# Altium schematic sheet DCDC_L5973D.SchDoc
size A4
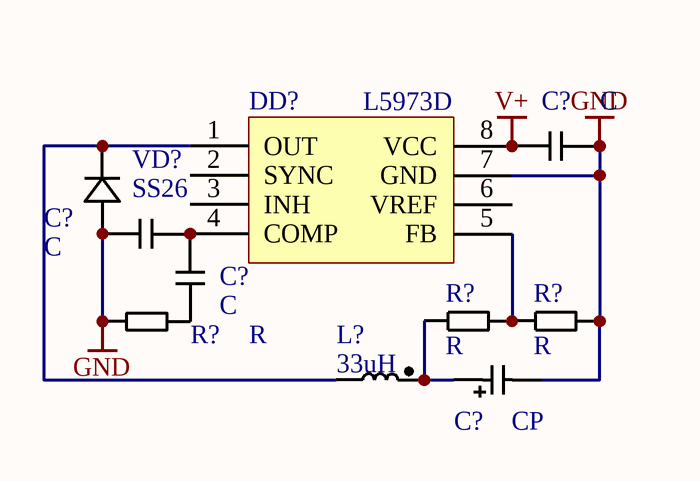
[diagram p0: DCDC_L5973D.SchDoc]

## Parts
(Parts that share a designator on the sheet are numbered #1, #2 ... from top to bottom, then left to right.)
C?#1  C  [C0805]
C?#2  C  [C0603]
C?#3  C  [C0603]
C?#4  CP  [SMD A]
DD?  L5973D  [HSOP-8EP]
L?  33uH  [SDR0403]
R?#1  R  [R0603]
R?#2  R  [R0603]
R?#3  R  [R0603]
VD?  SS26  [DO214]

## Nets
GND: C?#1.2 C?#2.1 C?#4.2 DD?.7(GND) R?#1.1 R?#3.2 VD?.1(K)
V+: C?#1.1 DD?.8(VCC)
NetC?#2_2: C?#2.2 C?#3.1 DD?.4(COMP)
NetC?#3_2: C?#3.2 R?#1.2
NetC?#4_1: C?#4.1 L?.1 R?#2.1
NetDD?_1: DD?.1(OUT) L?.2 VD?.2(A)
NetDD?_5: DD?.5(FB) R?#2.2 R?#3.1

Not connected (* = marked no-connect by the designer): DD? 2(SYNC) 3(INH) 6(VREF)

## Library data of the parts
C?#1-C?#3 = C: Capacitor
C?#4 = CP: Capacitor polarized
DD? = L5973D: 2.5A step-down DC-DC
L? = L: Inductor
R?#1-R?#3 = R: Resistor
VD? = Diode: SMD diode